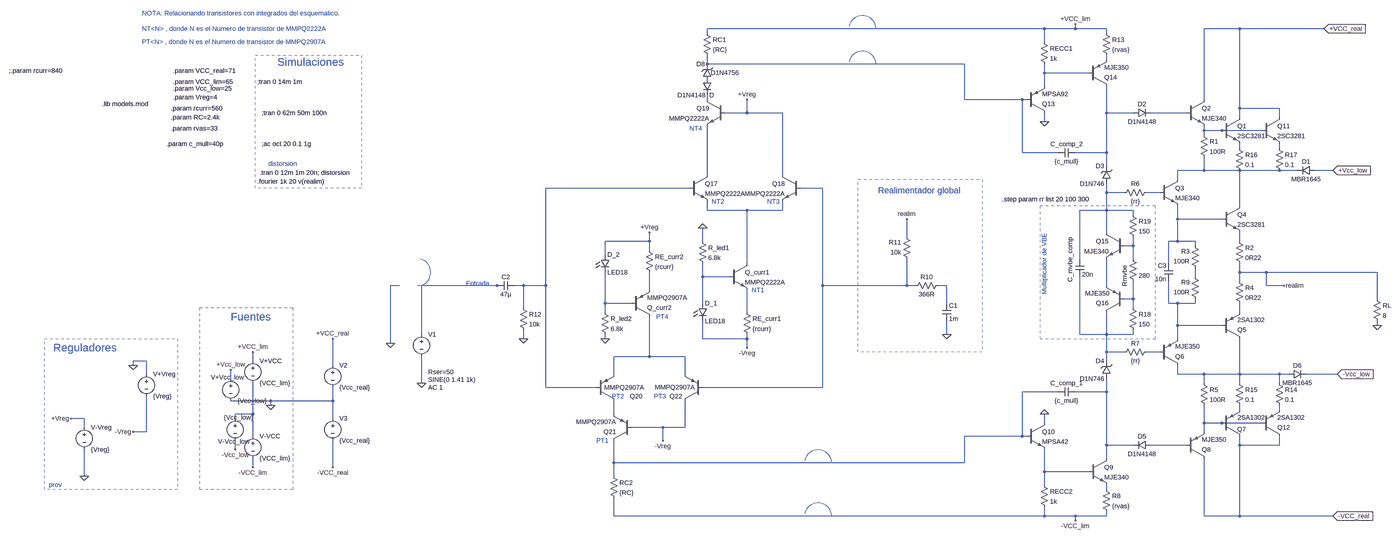
[diagram p0: schematic ampli-exp-equiv-modif.asc, whole sheet]
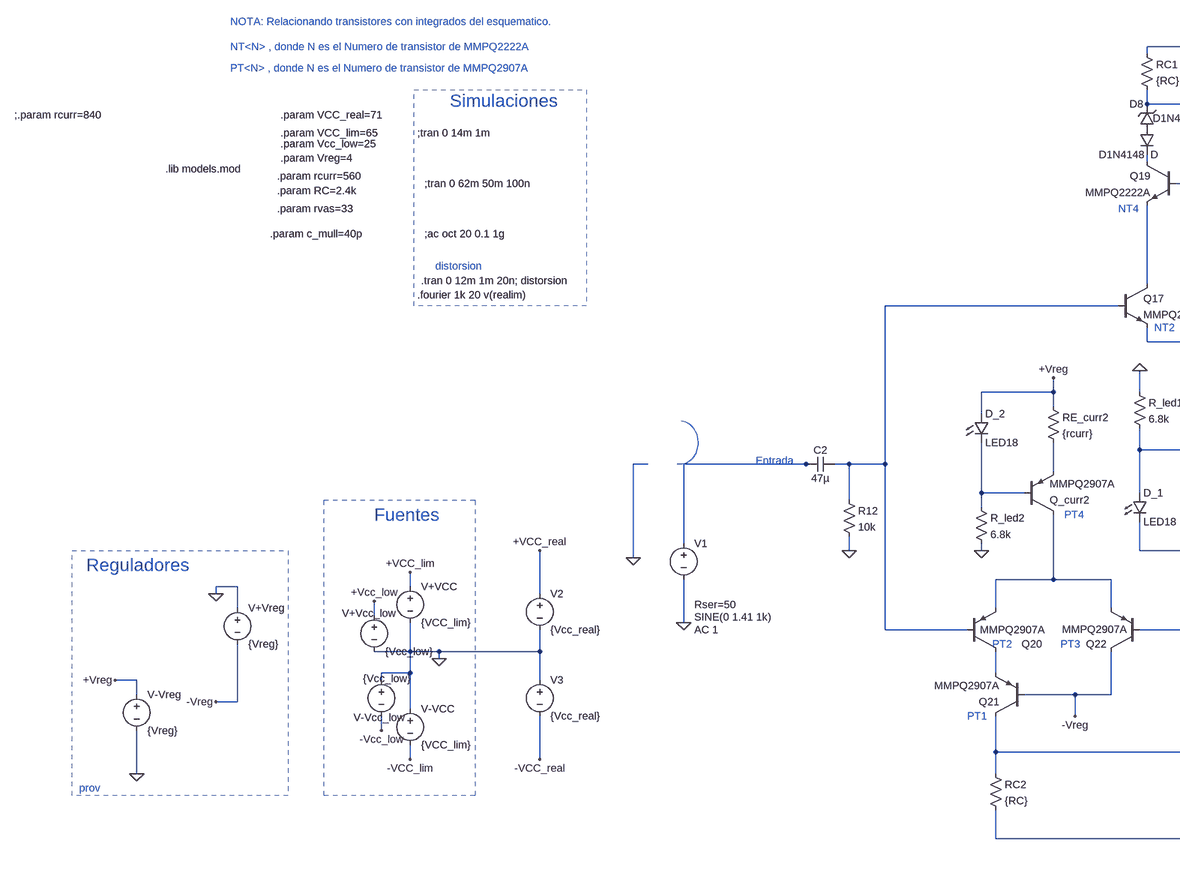
[diagram p1: schematic ampli-exp-equiv-modif.asc, part, row 1 of 1, column 1 of 2]
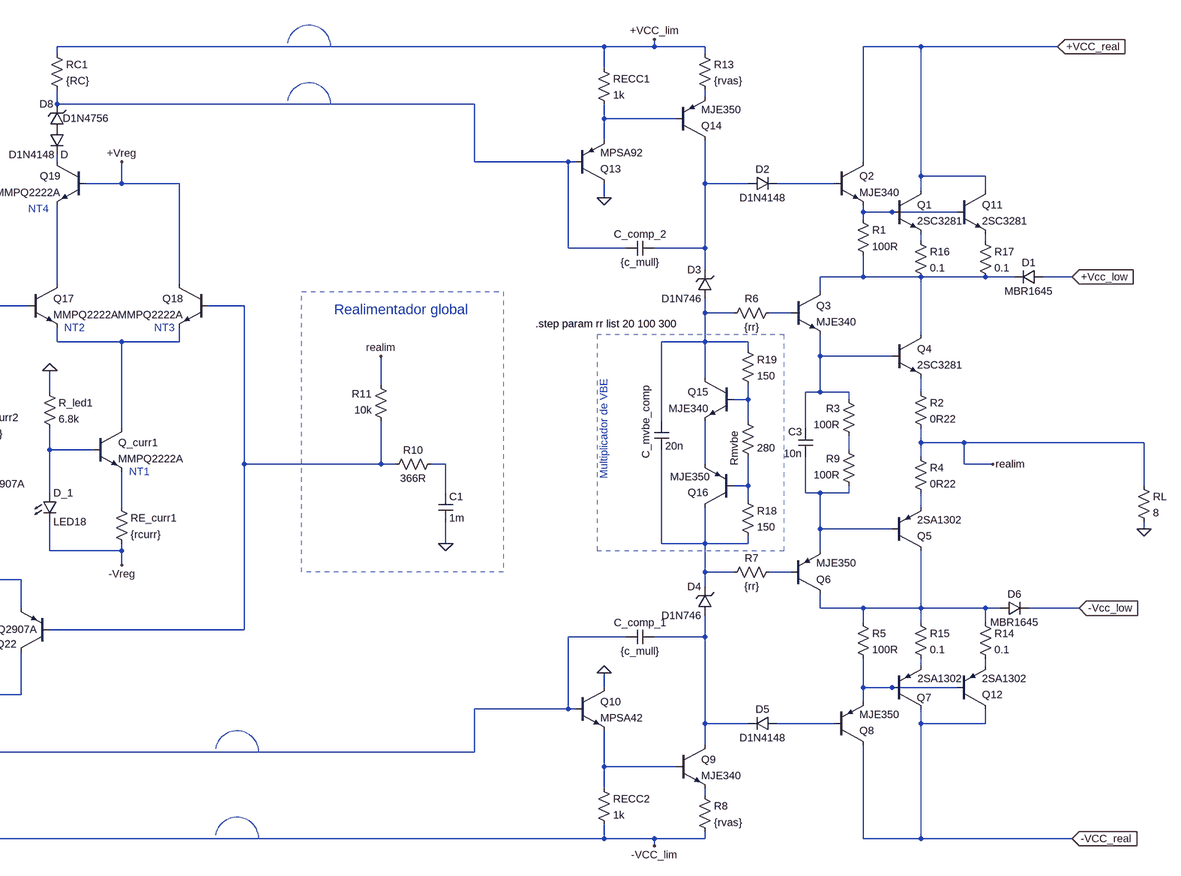
[diagram p2: schematic ampli-exp-equiv-modif.asc, part, row 1 of 1, column 2 of 2]
ampli-exp-equiv-modif.asc, the LTspice schematic file:
Version 4
SHEET 1 6132 2164
WIRE 1680 -752 464 -752
WIRE 1792 -752 1792 -768
WIRE 1792 -752 1680 -752
WIRE 1904 -752 1792 -752
WIRE 2384 -752 2256 -752
WIRE 2688 -752 2384 -752
WIRE 464 -736 464 -752
WIRE 1904 -736 1904 -752
WIRE 1680 -704 1680 -752
WIRE 1904 -640 1904 -656
WIRE 464 -624 464 -656
WIRE 1392 -624 464 -624
WIRE 1680 -592 1680 -624
WIRE 1840 -592 1680 -592
WIRE 464 -560 464 -576
WIRE 1680 -544 1680 -592
WIRE 464 -496 464 -512
WIRE 1392 -496 1392 -624
WIRE 1600 -496 1392 -496
WIRE 1616 -496 1600 -496
WIRE 2256 -496 2256 -752
WIRE 2384 -464 2384 -752
WIRE 2528 -464 2384 -464
WIRE 608 -448 608 -496
WIRE 608 -448 528 -448
WIRE 736 -448 608 -448
WIRE 1904 -448 1904 -544
WIRE 2000 -448 1904 -448
WIRE 2192 -448 2064 -448
WIRE 2384 -432 2384 -464
WIRE 2528 -432 2528 -464
WIRE 1680 -416 1680 -448
WIRE 2256 -384 2256 -400
WIRE 2320 -384 2256 -384
WIRE 2464 -384 2320 -384
WIRE 2256 -368 2256 -384
WIRE 2384 -320 2384 -336
WIRE 2528 -320 2528 -336
WIRE 1600 -304 1600 -496
WIRE 1728 -304 1600 -304
WIRE 1904 -304 1904 -448
WIRE 1904 -304 1792 -304
WIRE 1904 -256 1904 -304
WIRE 2256 -240 2256 -288
WIRE 2256 -240 2160 -240
WIRE 2384 -240 2256 -240
WIRE 2528 -240 2384 -240
WIRE 2592 -240 2528 -240
WIRE 2720 -240 2656 -240
WIRE 464 -224 464 -400
WIRE 736 -224 736 -448
WIRE 2160 -208 2160 -240
WIRE 400 -176 -128 -176
WIRE 880 -176 800 -176
WIRE 1904 -160 1904 -192
WIRE 1968 -160 1904 -160
WIRE 2096 -160 2048 -160
WIRE 2384 -112 2384 -240
WIRE 464 -96 464 -128
WIRE 608 -96 464 -96
WIRE 736 -96 736 -128
WIRE 736 -96 608 -96
WIRE 1904 -96 1904 -160
WIRE 1904 -96 1808 -96
WIRE 2000 -96 1904 -96
WIRE 2000 -80 2000 -96
WIRE 2160 -64 2160 -112
WIRE 2320 -64 2160 -64
WIRE 1904 -16 1904 -96
WIRE 1184 0 1184 -64
WIRE 256 16 256 -16
WIRE 256 16 96 16
WIRE 448 16 448 -32
WIRE 2160 16 2160 -64
WIRE 2160 16 2128 16
WIRE 2224 16 2160 16
WIRE 2384 16 2384 -16
WIRE 2000 32 2000 0
WIRE 2000 32 1968 32
WIRE 2224 32 2224 16
WIRE 256 48 256 16
WIRE 96 64 96 16
WIRE 1808 80 1808 -96
WIRE 2000 80 2000 32
WIRE 608 96 608 -96
WIRE 2128 96 2128 16
WIRE 2384 128 2384 96
WIRE 2480 128 2384 128
WIRE 2880 128 2480 128
WIRE 448 144 448 96
WIRE 544 144 448 144
WIRE 2224 144 2224 112
WIRE 2384 160 2384 128
WIRE -656 176 -688 176
WIRE -304 176 -576 176
WIRE -288 176 -304 176
WIRE -208 176 -240 176
WIRE -128 176 -128 -176
WIRE -128 176 -208 176
WIRE 880 176 880 -176
WIRE 1184 176 1184 80
WIRE 1184 176 880 176
WIRE 1216 176 1184 176
WIRE 1328 176 1296 176
WIRE 1904 176 1904 80
WIRE 2480 176 2480 128
WIRE 2544 176 2480 176
WIRE 256 192 256 128
WIRE 2000 224 2000 160
WIRE 2000 224 1968 224
WIRE 2880 224 2880 128
WIRE 96 240 96 128
WIRE 192 240 96 240
WIRE 448 240 448 144
WIRE 1328 240 1328 176
WIRE 2128 240 2128 160
WIRE 2160 240 2128 240
WIRE 2224 240 2224 224
WIRE 2224 240 2160 240
WIRE -208 256 -208 176
WIRE 2000 256 2000 224
WIRE 96 272 96 240
WIRE 608 272 608 192
WIRE 2384 272 2384 240
WIRE 2160 320 2160 240
WIRE 2320 320 2160 320
WIRE 2880 320 2880 304
WIRE -576 352 -576 176
WIRE 1328 352 1328 304
WIRE 1808 352 1808 144
WIRE 1904 352 1904 272
WIRE 1904 352 1808 352
WIRE 2000 352 2000 336
WIRE 2000 352 1904 352
WIRE -208 368 -208 336
WIRE 96 368 96 352
WIRE 448 368 448 304
WIRE 608 368 608 352
WIRE 608 368 448 368
WIRE 2160 368 2160 320
WIRE -688 384 -688 176
WIRE 608 400 608 368
WIRE 1904 416 1904 352
WIRE 1968 416 1904 416
WIRE 2096 416 2048 416
WIRE 256 432 256 288
WIRE 256 432 128 432
WIRE 384 432 256 432
WIRE -1568 448 -1616 448
WIRE -1184 448 -1184 416
WIRE 1904 448 1904 416
WIRE -1616 464 -1616 448
WIRE -896 464 -896 368
WIRE -1568 496 -1568 448
WIRE 128 496 128 432
WIRE 384 496 384 432
WIRE 2160 496 2160 464
WIRE 2256 496 2160 496
WIRE 2384 496 2384 368
WIRE 2384 496 2256 496
WIRE 2528 496 2384 496
WIRE 2560 496 2528 496
WIRE 2736 496 2624 496
WIRE -1264 512 -1264 480
WIRE -576 528 -576 432
WIRE 2256 528 2256 496
WIRE 2384 528 2384 496
WIRE 2528 528 2528 496
WIRE -128 544 -128 176
WIRE 64 544 -128 544
WIRE 880 544 880 176
WIRE 880 544 448 544
WIRE 1728 560 1600 560
WIRE 1904 560 1904 512
WIRE 1904 560 1792 560
WIRE -1184 592 -1184 528
WIRE -1184 592 -1264 592
WIRE -1120 592 -1184 592
WIRE -896 592 -896 544
WIRE -896 592 -1120 592
WIRE -1120 608 -1120 592
WIRE 2384 624 2384 608
WIRE 2528 624 2528 608
WIRE -1184 640 -1184 592
WIRE -1184 640 -1248 640
WIRE 128 640 128 592
WIRE -1792 656 -1840 656
WIRE -1248 656 -1248 640
WIRE -896 656 -896 592
WIRE 1680 672 1680 640
WIRE 2256 672 2256 608
WIRE 2320 672 2256 672
WIRE 2464 672 2320 672
WIRE -1792 688 -1792 656
WIRE 304 688 192 688
WIRE 384 688 384 592
WIRE 384 688 304 688
WIRE -1568 704 -1568 576
WIRE -1568 704 -1616 704
WIRE 2256 704 2256 672
WIRE -1184 720 -1184 640
WIRE 1600 720 1600 560
WIRE 1600 720 1392 720
WIRE 1616 720 1600 720
WIRE 304 736 304 688
WIRE 1904 752 1904 560
WIRE 2000 752 1904 752
WIRE 2192 752 2064 752
WIRE 2384 752 2384 720
WIRE 2528 752 2528 720
WIRE 2528 752 2384 752
WIRE -1248 768 -1248 736
WIRE 1904 800 1904 752
WIRE 128 816 128 736
WIRE 1392 816 1392 720
WIRE 1392 816 128 816
WIRE -1184 832 -1184 800
WIRE -896 832 -896 736
WIRE 1680 848 1680 768
WIRE 1840 848 1680 848
WIRE -1792 864 -1792 768
WIRE 128 864 128 816
WIRE 1680 896 1680 848
WIRE 1904 912 1904 896
WIRE 128 1008 128 944
WIRE 1680 1008 1680 976
WIRE 1680 1008 128 1008
WIRE 1792 1008 1680 1008
WIRE 1904 1008 1904 992
WIRE 1904 1008 1792 1008
WIRE 2256 1008 2256 800
WIRE 2384 1008 2384 752
WIRE 2384 1008 2256 1008
WIRE 2720 1008 2384 1008
WIRE 1792 1024 1792 1008
FLAG -1120 608 0
FLAG -1184 416 +VCC_lim
FLAG -1264 480 +Vcc_low
FLAG -1248 768 -Vcc_low
FLAG -1184 832 -VCC_lim
FLAG 2720 1008 -VCC_real
IOPIN 2720 1008 In
FLAG 2736 496 -Vcc_low
IOPIN 2736 496 In
FLAG 2688 -752 +VCC_real
IOPIN 2688 -752 In
FLAG 2720 -240 +Vcc_low
IOPIN 2720 -240 In
FLAG 1184 -64 realim
FLAG 2544 176 realim
FLAG -208 368 0
FLAG 1680 -416 0
FLAG 1680 640 0
FLAG -1840 656 +Vreg
FLAG -1616 704 -Vreg
FLAG 608 -496 +Vreg
FLAG 608 400 -Vreg
FLAG 256 -16 +Vreg
FLAG 304 736 -Vreg
FLAG 96 368 0
FLAG 448 -32 0
FLAG 1328 352 0
FLAG 2880 320 0
FLAG -576 528 0
FLAG -1792 864 0
FLAG -1616 464 0
FLAG 1792 -768 +VCC_lim
FLAG 1792 1024 -VCC_lim
FLAG -896 368 +VCC_real
FLAG -896 832 -VCC_real
FLAG -688 384 0
SYMBOL voltage -1248 640 R0
WINDOW 0 -62 99 Left 2
WINDOW 3 -41 12 Left 2
WINDOW 123 0 0 Left 2
WINDOW 39 0 0 Left 2
SYMATTR InstName V-Vcc_low
SYMATTR Value {Vcc_low}
SYMBOL voltage -1184 432 R0
WINDOW 123 0 0 Left 2
WINDOW 39 0 0 Left 2
SYMATTR InstName V+VCC
SYMATTR Value {VCC_lim}
SYMBOL voltage -1264 496 R0
WINDOW 0 -72 11 Left 2
WINDOW 123 0 0 Left 2
WINDOW 39 0 0 Left 2
SYMATTR InstName V+Vcc_low
SYMATTR Value {Vcc_low}
SYMBOL voltage -1184 704 R0
WINDOW 123 0 0 Left 2
WINDOW 39 0 0 Left 2
SYMATTR InstName V-VCC
SYMATTR Value {VCC_lim}
SYMBOL npn 2320 -432 R0
SYMATTR InstName Q1
SYMATTR Value 2SC3281
SYMBOL npn 2192 -496 R0
SYMATTR InstName Q2
SYMATTR Value MJE340
SYMBOL res 2240 -384 R0
SYMATTR InstName R1
SYMATTR Value 100R
SYMBOL diode 2656 -224 M270
WINDOW 0 32 32 VTop 2
WINDOW 3 0 32 VBottom 2
SYMATTR InstName D1
SYMATTR Value MBR1645
SYMBOL diode 2000 -432 R270
WINDOW 0 32 32 VTop 2
WINDOW 3 0 32 VBottom 2
SYMATTR InstName D2
SYMATTR Value D1N4148
SYMBOL zener 1920 -192 R180
WINDOW 0 24 64 Left 2
WINDOW 3 24 0 Left 2
SYMATTR InstName D3
SYMATTR Value D1N746
SYMBOL npn 2096 -208 R0
SYMATTR InstName Q3
SYMATTR Value MJE340
SYMBOL npn 2320 -112 R0
SYMATTR InstName Q4
SYMATTR Value 2SC3281
SYMBOL res 2368 0 R0
SYMATTR InstName R2
SYMATTR Value 0R22
SYMBOL res 2240 128 R180
WINDOW 0 36 76 Left 2
WINDOW 3 36 40 Left 2
SYMATTR InstName R3
SYMATTR Value 100R
SYMBOL res 2368 144 R0
SYMATTR InstName R4
SYMATTR Value 0R22
SYMBOL pnp 2320 368 M180
SYMATTR InstName Q5
SYMATTR Value 2SA1302
SYMBOL pnp 2096 464 M180
SYMATTR InstName Q6
SYMATTR Value MJE350
SYMBOL pnp 2320 720 M180
WINDOW 0 55 25 Left 2
WINDOW 3 57 68 Left 2
SYMATTR InstName Q7
SYMATTR Value 2SA1302
SYMBOL pnp 2192 800 M180
SYMATTR InstName Q8
SYMATTR Value MJE350
SYMBOL res 2240 512 R0
SYMATTR InstName R5
SYMATTR Value 100R
SYMBOL zener 1920 512 R180
WINDOW 0 24 64 Left 2
WINDOW 3 24 0 Left 2
SYMATTR InstName D4
SYMATTR Value D1N746
SYMBOL diode 2064 736 R90
WINDOW 0 0 32 VBottom 2
WINDOW 3 32 32 VTop 2
SYMATTR InstName D5
SYMATTR Value D1N4148
SYMBOL diode 2560 512 R270
WINDOW 0 32 32 VTop 2
WINDOW 3 0 32 VBottom 2
SYMATTR InstName D6
SYMATTR Value MBR1645
SYMBOL res 2064 -176 R90
WINDOW 0 0 56 VBottom 2
WINDOW 3 32 56 VTop 2
SYMATTR InstName R6
SYMATTR Value {rr}
SYMBOL res 2064 400 R90
WINDOW 0 0 56 VBottom 2
WINDOW 3 32 56 VTop 2
SYMATTR InstName R7
SYMATTR Value {rr}
SYMBOL npn 1840 800 R0
SYMATTR InstName Q9
SYMATTR Value MJE340
SYMBOL res 1888 896 R0
SYMATTR InstName R8
SYMATTR Value {rvas}
SYMBOL npn 1616 672 R0
SYMATTR InstName Q10
SYMATTR Value MPSA42
SYMBOL res 2240 240 R180
WINDOW 0 36 76 Left 2
WINDOW 3 36 40 Left 2
SYMATTR InstName R9
SYMATTR Value 100R
SYMBOL res 1200 192 R270
WINDOW 0 32 56 VTop 2
WINDOW 3 0 56 VBottom 2
SYMATTR InstName R10
SYMATTR Value 366R
SYMBOL res 1200 96 R180
WINDOW 0 36 76 Left 2
WINDOW 3 36 40 Left 2
SYMATTR InstName R11
SYMATTR Value 10k
SYMBOL res -224 240 R0
SYMATTR InstName R12
SYMATTR Value 10k
SYMBOL cap 1312 240 R0
SYMATTR InstName C1
SYMATTR Value 1m
SYMBOL cap -240 160 R90
WINDOW 0 0 32 VBottom 2
WINDOW 3 32 32 VTop 2
SYMATTR InstName C2
SYMATTR Value 47µ
SYMBOL cap 1792 544 R90
WINDOW 0 0 32 VBottom 2
WINDOW 3 32 32 VTop 2
SYMATTR InstName C_comp_1
SYMATTR Value {c_mull}
SYMBOL cap 2144 160 R180
WINDOW 0 24 56 Left 2
WINDOW 3 24 8 Left 2
SYMATTR InstName C3
SYMATTR Value 10n
SYMBOL npn 2464 -432 R0
SYMATTR InstName Q11
SYMATTR Value 2SC3281
SYMBOL pnp 2464 720 M180
SYMATTR InstName Q12
SYMATTR Value 2SA1302
SYMBOL pnp 1616 -448 M180
SYMATTR InstName Q13
SYMATTR Value MPSA92
SYMBOL pnp 1840 -544 M180
SYMATTR InstName Q14
SYMATTR Value MJE350
SYMBOL cap 1792 -320 R90
WINDOW 0 0 32 VBottom 2
WINDOW 3 32 32 VTop 2
SYMATTR InstName C_comp_2
SYMATTR Value {c_mull}
SYMBOL res 1888 -752 R0
SYMATTR InstName R13
SYMATTR Value {rvas}
SYMBOL res 2512 512 R0
SYMATTR InstName R14
SYMATTR Value 0.1
SYMBOL res 2368 512 R0
SYMATTR InstName R15
SYMATTR Value 0.1
SYMBOL res 2368 -336 R0
SYMATTR InstName R16
SYMATTR Value 0.1
SYMBOL res 2512 -336 R0
SYMATTR InstName R17
SYMATTR Value 0.1
SYMBOL npn 1968 -16 M0
SYMATTR InstName Q15
SYMATTR Value MJE340
SYMBOL pnp 1968 272 R180
WINDOW 0 56 33 Left 2
WINDOW 3 53 68 Left 2
SYMATTR InstName Q16
SYMATTR Value MJE350
SYMBOL res 1984 64 R0
WINDOW 0 -14 116 VLeft 2
SYMATTR InstName Rmvbe
SYMATTR Value 280
SYMBOL res 1984 240 R0
SYMATTR InstName R18
SYMATTR Value 150
SYMBOL cap 1792 80 R0
WINDOW 0 -19 83 VLeft 2
SYMATTR InstName C_mvbe_comp
SYMATTR Value 20n
SYMBOL res 1984 -96 R0
SYMATTR InstName R19
SYMATTR Value 150
SYMBOL voltage -1568 480 R0
WINDOW 123 0 0 Left 2
WINDOW 39 0 0 Left 2
SYMATTR InstName V+Vreg
SYMATTR Value {Vreg}
SYMBOL npn 544 96 R0
SYMATTR InstName Q_curr1
SYMATTR Value MMPQ2222A
SYMBOL npn 400 -224 R0
SYMATTR InstName Q17
SYMATTR Value MMPQ2222A
SYMBOL npn 800 -224 M0
SYMATTR InstName Q18
SYMATTR Value MMPQ2222A
SYMBOL res 432 0 R0
SYMATTR InstName R_led1
SYMATTR Value 6.8k
SYMBOL res 592 256 R0
SYMATTR InstName RE_curr1
SYMATTR Value {rcurr}
SYMBOL LED 432 240 R0
SYMATTR InstName D_1
SYMATTR Value LED18
SYMBOL res 448 -752 R0
SYMATTR InstName RC1
SYMATTR Value {RC}
SYMBOL npn 528 -496 M0
SYMATTR InstName Q19
SYMATTR Value MMPQ2222A
SYMBOL res 240 32 R0
SYMATTR InstName RE_curr2
SYMATTR Value {rcurr}
SYMBOL pnp 192 288 M180
SYMATTR InstName Q_curr2
SYMATTR Value MMPQ2907A
SYMBOL pnp 64 592 M180
WINDOW 0 121 16 Left 2
WINDOW 3 29 48 Left 2
SYMATTR InstName Q20
SYMATTR Value MMPQ2907A
SYMBOL pnp 192 736 R180
SYMATTR InstName Q21
SYMATTR Value MMPQ2907A
SYMBOL res 112 848 R0
SYMATTR InstName RC2
SYMATTR Value {RC}
SYMBOL pnp 448 592 R180
WINDOW 0 74 16 Left 2
WINDOW 3 28 49 Left 2
SYMATTR InstName Q22
SYMATTR Value MMPQ2907A
SYMBOL LED 80 64 R0
SYMATTR InstName D_2
SYMATTR Value LED18
SYMBOL res 80 256 R0
SYMATTR InstName R_led2
SYMATTR Value 6.8k
SYMBOL res 1664 880 R0
SYMATTR InstName RECC2
SYMATTR Value 1k
SYMBOL res 1664 -720 R0
SYMATTR InstName RECC1
SYMATTR Value 1k
SYMBOL voltage -576 336 R0
WINDOW 3 24 180 Left 2
WINDOW 123 24 208 Left 2
WINDOW 39 24 152 Left 2
SYMATTR Value SINE(0 1.41 1k)
SYMATTR Value2 AC 1
SYMATTR SpiceLine Rser=50
SYMATTR InstName V1
SYMBOL res 2864 208 R0
SYMATTR InstName RL
SYMATTR Value 8
SYMBOL voltage -1792 672 R0
WINDOW 123 0 0 Left 2
WINDOW 39 0 0 Left 2
SYMATTR InstName V-Vreg
SYMATTR Value {Vreg}
SYMBOL voltage -896 448 R0
WINDOW 123 0 0 Left 2
WINDOW 39 0 0 Left 2
SYMATTR InstName V2
SYMATTR Value {Vcc_real}
SYMBOL voltage -896 640 R0
WINDOW 123 0 0 Left 2
WINDOW 39 0 0 Left 2
SYMATTR InstName V3
SYMATTR Value {Vcc_real}
SYMBOL diode 448 -576 R0
WINDOW 0 -91 64 Left 2
SYMATTR InstName D1N4148
SYMBOL zener 480 -560 R180
WINDOW 0 24 64 Left 2
WINDOW 3 -99 33 Left 2
SYMATTR InstName D8
SYMATTR Value D1N4756
SYMATTR Description Diode
SYMATTR Type diode
TEXT -1168 -560 Left 2 !;tran 0 14m 1m
TEXT -1168 -200 Left 2 !.fourier 1k 20 v(realim)
TEXT -1264 288 Left 4 ;Fuentes
TEXT -1096 -632 Left 4 ;Simulaciones
TEXT -1160 -232 Left 2 !.tran 0 12m 1m 20n; distorsion
TEXT -1128 -264 Left 2 ;distorsion
TEXT -1152 -336 Left 2 !;ac oct 20 0.1 1g
TEXT -1728 -480 Left 2 !.lib models.mod
TEXT 1680 208 VLeft 2 ;Multiplicador de VBE
TEXT -1904 400 Left 4 ;Reguladores
TEXT -1920 896 Left 2 ;prov
TEXT 1080 -168 Left 3 ;Realimentador global
TEXT 480 -128 Left 2 ;NT2
TEXT 680 -128 Left 2 ;NT3
TEXT 624 192 Left 2 ;NT1
TEXT 400 -392 Left 2 ;NT4
TEXT 120 576 Left 2 ;PT2
TEXT -1584 -752 Left 2 ;NT<N> , donde N es el Numero de transistor de MMPQ2222A
TEXT -1584 -704 Left 2 ;PT<N> , donde N es el Numero de transistor de MMPQ2907A
TEXT -1584 -808 Left 2 ;NOTA: Relacionando transistores con integrados del esquematico.
TEXT 64 736 Left 2 ;PT1
TEXT 272 576 Left 2 ;PT3
TEXT 280 288 Left 2 ;PT4
TEXT -416 168 Left 2 ;Entrada
TEXT -1472 -536 Left 2 !.param Vcc_low=25
TEXT -1472 -504 Left 2 !.param Vreg=4
TEXT -1480 -432 Left 2 !.param RC=2.4k
TEXT -1480 -392 Left 2 !.param rvas=33
TEXT -1480 -464 Left 2 !.param rcurr=560
TEXT -1152 -448 Left 2 !;tran 0 62m 50m 100n
TEXT -2064 -600 Left 2 !;.param rcurr=840
TEXT -1496 -336 Left 2 !.param c_mull=40p
TEXT -1472 -560 Left 2 !.param VCC_lim=65
TEXT -1472 -600 Left 2 !.param VCC_real=71
TEXT 1528 -136 Left 2 !.step param rr list 20 100 300
RECTANGLE Normal -1040 912 -1376 256 2
RECTANGLE Normal -792 -176 -1176 -656 2
RECTANGLE Normal 1664 368 2080 -112 2
RECTANGLE Normal -1456 912 -1936 368 2
RECTANGLE Normal 1456 416 1008 -208 2
ARC Normal 816 768 912 864 926 817 801 805
ARC Normal 976 -672 1072 -576 1086 -623 961 -635
ARC Normal -544 80 -624 176 -593 190 -581 65
ARC Normal 816 960 912 1056 926 1009 801 997
ARC Normal 976 -800 1072 -704 1086 -751 961 -763

The netlist it stands for:
* ampli-exp-equiv-modif.asc
V-Vcc_low 0 -Vcc_low {Vcc_low}
V+VCC +VCC_lim 0 {VCC_lim}
V+Vcc_low +Vcc_low 0 {Vcc_low}
V-VCC 0 -VCC_lim {VCC_lim}
Q1 +VCC_real N008 N009 0 2SC3281
Q2 +VCC_real N007 N008 0 MJE340
R1 N008 N011 100R
D1 +Vcc_low N011 MBR1645
D2 N006 N007 D1N4148
D3 N015 N006 D1N746
Q3 N011 N016 N018 0 MJE340
Q4 N011 N018 N019 0 2SC3281
R2 N019 realim 0R22
R3 N022 N018 100R
R4 realim N031 0R22
Q5 N035 N029 N031 0 2SA1302
Q6 N035 N033 N029 0 MJE350
Q7 -VCC_real N041 N038 0 2SA1302
Q8 -VCC_real N042 N041 0 MJE350
R5 N035 N041 100R
D4 N037 N032 D1N746
D5 N042 N037 D1N4148
D6 N035 -Vcc_low MBR1645
R6 N016 N015 {rr}
R7 N033 N032 {rr}
Q9 N037 N043 N044 0 MJE340
R8 N044 -VCC_lim {rvas}
Q10 0 N036 N043 0 MPSA42
R9 N029 N022 100R
R10 N014 N024 366R
R11 N014 realim 10k
R12 N013 0 10k
C1 N024 0 1m
C2 N013 N023 47µ
C_comp_1 N037 N036 {c_mull}
C3 N029 N018 10n
Q11 +VCC_real N008 N010 0 2SC3281
Q12 -VCC_real N041 N039 0 2SA1302
Q13 0 N002 N003 0 MPSA92
Q14 N006 N003 N001 0 MJE350
C_comp_2 N006 N002 {c_mull}
R13 +VCC_lim N001 {rvas}
R14 N035 N039 0.1
R15 N035 N038 0.1
R16 N009 N011 0.1
R17 N010 N011 0.1
Q15 N015 N020 N025 0 MJE340
Q16 N032 N027 N025 0 MJE350
Rmvbe N020 N027 280
R18 N027 N032 150
C_mvbe_comp N015 N032 20n
R19 N015 N020 150
V+Vreg 0 -Vreg {Vreg}
Q_curr1 N017 N021 N030 0 MMPQ2222A
Q17 N012 N013 N017 0 MMPQ2222A
Q18 +Vreg N014 N017 0 MMPQ2222A
R_led1 0 N021 6.8k
RE_curr1 N030 -Vreg {rcurr}
D_1 N021 -Vreg LED18
RC1 +VCC_lim N002 {RC}
Q19 N005 +Vreg N012 0 MMPQ2222A
RE_curr2 +Vreg N026 {rcurr}
Q_curr2 N034 N028 N026 0 MMPQ2907A
Q20 N040 N013 N034 0 MMPQ2907A
Q21 N036 -Vreg N040 0 MMPQ2907A
RC2 N036 -VCC_lim {RC}
Q22 -Vreg N014 N034 0 MMPQ2907A
D_2 +Vreg N028 LED18
R_led2 N028 0 6.8k
RECC2 N043 -VCC_lim 1k
RECC1 +VCC_lim N003 1k
V1 N023 0 SINE(0 1.41 1k) AC 1 Rser=50
RL realim 0 8
V-Vreg +Vreg 0 {Vreg}
V2 +VCC_real 0 {Vcc_real}
V3 0 -VCC_real {Vcc_real}
D1N4148 N004 N005 D
D8 N004 N002 D1N4756
.model D D
.lib standard.dio
.model NPN NPN
.model PNP PNP
.lib standard.bjt
;tran 0 14m 1m
.fourier 1k 20 v(realim)
* Fuentes
* Simulaciones
.tran 0 12m 1m 20n; distorsion
* distorsion
;ac oct 20 0.1 1g
.lib models.mod
* Multiplicador de VBE
* Reguladores
* prov
* Realimentador global
* NT2
* NT3
* NT1
* NT4
* PT2
* NT<N> , donde N es el Numero de transistor de MMPQ2222A
* PT<N> , donde N es el Numero de transistor de MMPQ2907A
* NOTA: Relacionando transistores con integrados del esquematico.
* PT1
* PT3
* PT4
* Entrada
.param Vcc_low=25
.param Vreg=4
.param RC=2.4k
.param rvas=33
.param rcurr=560
;tran 0 62m 50m 100n
;.param rcurr=840
.param c_mull=40p
.param VCC_lim=65
.param VCC_real=71
.step param rr list 20 100 300
.backanno
.end